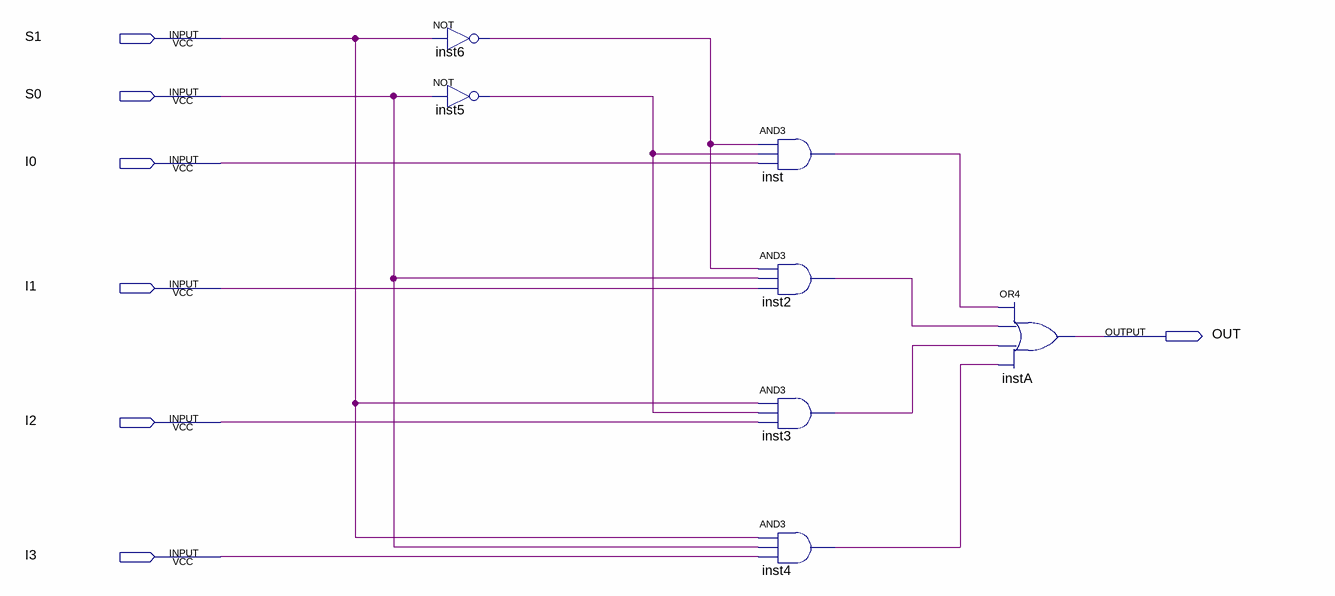
[diagram p0: schematic sheet]
// Quartus schematic MUX41.bdf as structural Verilog: 7 symbols, 7 pins
module MUX41 (
  input  S1,
  input  S0,
  input  I0,
  input  I1,
  input  I2,
  input  I3,
  output OUT
);

  wire inst2_out, inst3_out, inst4_out, inst5_out, inst6_out, inst_out;

  not inst6 (inst6_out, S1);
  not inst5 (inst5_out, S0);
  and inst (inst_out, inst6_out, inst5_out, I0);
  and inst2 (inst2_out, inst6_out, S0, I1);
  and inst3 (inst3_out, S1, inst5_out, I2);
  and inst4 (inst4_out, S1, S0, I3);
  or instA (OUT, inst_out, inst2_out, inst3_out, inst4_out);
endmodule
